# Altium project RingLED.PrjPcb
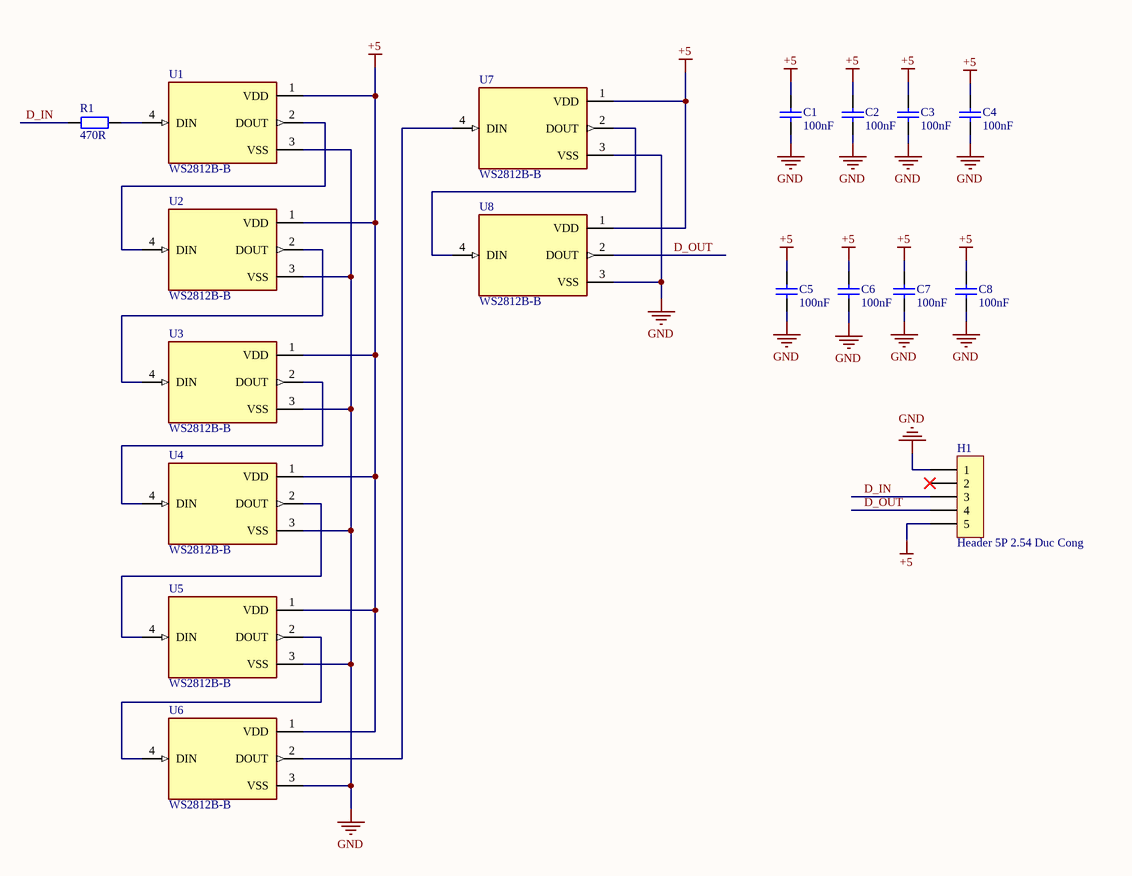
[diagram p0: RGB_Ring_SCH.SchDoc]
1 sheet, 18 parts. Net scope: global (net labels, ports and power ports of the same name join across sheets).
Board file: RGB_Ring_PCB.PcbDoc

## Sheet RGB_Ring_SCH.SchDoc
size A3; SheetNumber: 1; SheetTotal: 1

### Parts
C1  100nF  [tu 0603]
C2  100nF  [tu 0603]
C3  100nF  [tu 0603]
C4  100nF  [tu 0603]
C5  100nF  [tu 0603]
C6  100nF  [tu 0603]
C7  100nF  [tu 0603]
C8  100nF  [tu 0603]
H1  Header 5P 2.54 Duc Cong  [Header 5P DC 2.54]
R1  470R  [tro smd 0603]
U1  WS2812B-B  [LED_WS2812B-B]
U2  WS2812B-B  [LED_WS2812B-B]
U3  WS2812B-B  [LED_WS2812B-B]
U4  WS2812B-B  [LED_WS2812B-B]
U5  WS2812B-B  [LED_WS2812B-B]
U6  WS2812B-B  [LED_WS2812B-B]
U7  WS2812B-B  [LED_WS2812B-B]
U8  WS2812B-B  [LED_WS2812B-B]

### Nets
+5: C1.1 C2.1 C3.1 C4.1 C5.1 C6.1 C7.1 C8.1 H1.5 U1.1(VDD) U2.1(VDD) U3.1(VDD) U4.1(VDD) U5.1(VDD) U6.1(VDD) U7.1(VDD) U8.1(VDD)
GND: C1.2 C2.2 C3.2 C4.2 C5.2 C6.2 C7.2 C8.2 H1.1 U1.3(VSS) U2.3(VSS) U3.3(VSS) U4.3(VSS) U5.3(VSS) U6.3(VSS) U7.3(VSS) U8.3(VSS)
D_IN: H1.3 R1.1
D_OUT: H1.4 U8.2(DOUT)
NetR1_2: R1.2 U1.4(DIN)
NetU1_2: U1.2(DOUT) U2.4(DIN)
NetU2_2: U2.2(DOUT) U3.4(DIN)
NetU3_2: U3.2(DOUT) U4.4(DIN)
NetU4_2: U4.2(DOUT) U5.4(DIN)
NetU5_2: U5.2(DOUT) U6.4(DIN)
NetU6_2: U6.2(DOUT) U7.4(DIN)
NetU7_2: U7.2(DOUT) U8.4(DIN)

Not connected (* = marked no-connect by the designer): H1 2*

### Library data of the parts
C1-C8 = Tu 0603 104 50V 10%: Dán; Don_Vi: Con; So_Chan: 2; Ten_Linh_Kien: Tụ 0603 104-100nF 10% 50V; Ma_Hang: MH004568; Chung_Loai: Dán; Kieu_Chan: *
H1 = Header 5P 2.54 Duc Cong: Cắm; Ten_Linh_Kien: Header 5P XH2.54-5P Đực Cong; Don_Vi: Con; Ma_Hang: MH001308; Chung_Loai: Cắm
R1 = Tro 0603 5% 470R: Dán; Don_Vi: Con; So_Chan: 2; Ten_Linh_Kien: Trở 0603 5% 470R; Ma_Hang: MH006328; Chung_Loai: Dán; Kieu_Chan: *
U1-U8 = WS2812B-B: Intelligent control LED integrated light source; Availability: Unavailable; Price: None; Package: None; MP: WS2812B-B; Value: *